# Altium schematic sheet uMultimeter_MAIN_Sch.SchDoc: MicroMultimeter
size 203 x 127 mm; Author: Hom; CompanyName: KitSprout; DrawnBy: Hom; Engineer: Hom; Organization: KitSprout; Revision: B; SheetNumber: 1; SheetTotal: 1; License: CC BY-SA 4.0; Version: 2.0; LibVersion: 2.1; PageSetup: Record=PageOptions|CenterHorizontal=True|CenterVertical=True|PrintScale=1.00|XCorrection=1.00|YCorrection=1.00|PrintKind=0|BorderSize=5000000|LeftOffset=0|BottomOffset=0|Orientation=2|PaperLength=1000|PaperWidth=1000|Scale=100|PaperSource=7|PrintQuality=-3|MediaType=1|DitherType=10|PrintScaleMode=0|PaperKind=A4|PaperIndex=9
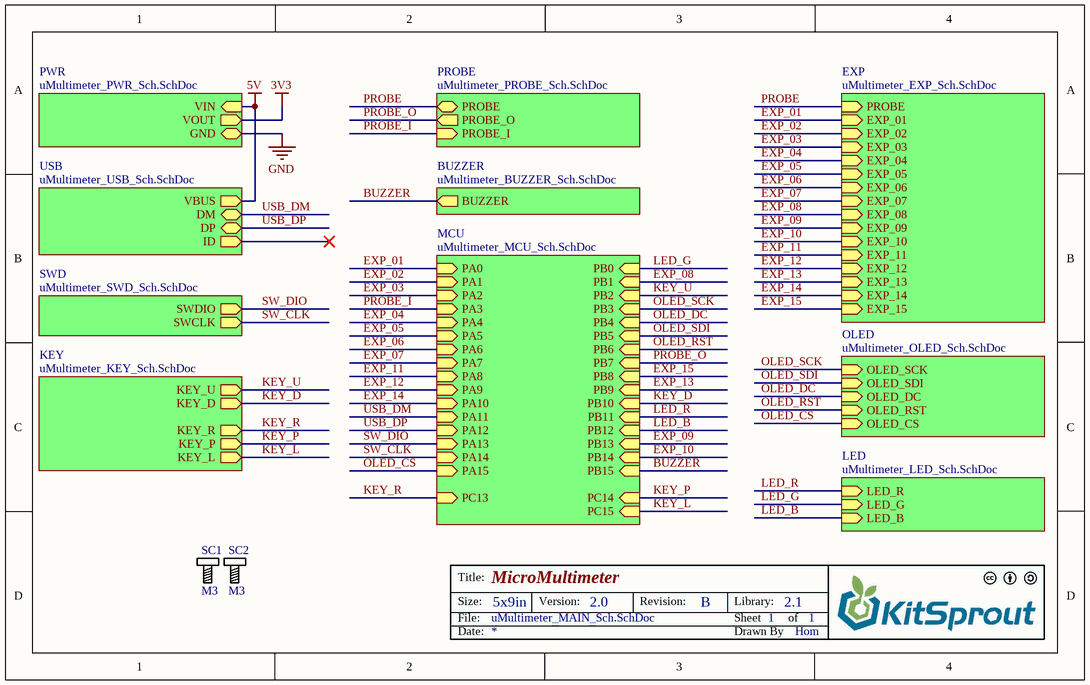
[diagram p0: uMultimeter_MAIN_Sch.SchDoc]

## Parts
SC1  M3  [SCRREW_M3]
SC2  M3  [SCRREW_M3]

## Sub-sheets
BUZZER = uMultimeter_BUZZER_Sch.SchDoc: BUZZER (out)
EXP = uMultimeter_EXP_Sch.SchDoc: PROBE (in), EXP_01 (in), EXP_02 (in), EXP_03 (in), EXP_04 (in), EXP_05 (in), EXP_06 (in), EXP_07 (in), EXP_08 (in), EXP_09 (in), EXP_10 (in), EXP_11 (in), EXP_12 (in), EXP_13 (in), EXP_14 (in), EXP_15 (in)
KEY = uMultimeter_KEY_Sch.SchDoc: KEY_D (out), KEY_U (out), KEY_P (out), KEY_R (out), KEY_L (out)
LED = uMultimeter_LED_Sch.SchDoc: LED_G (in), LED_R (in), LED_B (in)
MCU = uMultimeter_MCU_Sch.SchDoc: PA0 (in), PA1 (in), PA2 (in), PA3 (in), PA4 (in), PA5 (in), PA6 (in), PA7 (in), PA8 (in), PA9 (in), PA10 (in), PA11 (in), PA12 (in), PA13 (in), PA14 (in), PA15 (in), PB0 (in), PB1 (in), PB2 (in), PB3 (in), PB4 (in), PB5 (in), PB6 (in), PB7 (in), PB8 (in), PB9 (in), PB10 (in), PB11 (in), PB12 (in), PB13 (in), PB14 (in), PB15 (in), PC13 (in), PC14 (in), PC15 (in)
OLED = uMultimeter_OLED_Sch.SchDoc: OLED_SDI (in), OLED_SCK (in), OLED_DC (in), OLED_RST (in), OLED_CS (in)
PROBE = uMultimeter_PROBE_Sch.SchDoc: PROBE (bidir), PROBE_I (in), PROBE_O (out)
PWR = uMultimeter_PWR_Sch.SchDoc: VOUT (out), VIN (in), GND (bidir)
SWD = uMultimeter_SWD_Sch.SchDoc: SWDIO (out), SWCLK (out)
USB = uMultimeter_USB_Sch.SchDoc: DM (bidir), VBUS (out), DP (bidir), ID (out)

## Nets
3V3: sheet PWR/VOUT
5V: sheet PWR/VIN, sheet USB/VBUS
GND: sheet PWR/GND
BUZZER: sheet BUZZER/BUZZER, sheet MCU/PB15
EXP_01: sheet EXP/EXP_01, sheet MCU/PA0
EXP_02: sheet EXP/EXP_02, sheet MCU/PA1
EXP_03: sheet EXP/EXP_03, sheet MCU/PA2
EXP_04: sheet EXP/EXP_04, sheet MCU/PA4
EXP_05: sheet EXP/EXP_05, sheet MCU/PA5
EXP_06: sheet EXP/EXP_06, sheet MCU/PA6
EXP_07: sheet EXP/EXP_07, sheet MCU/PA7
EXP_08: sheet EXP/EXP_08, sheet MCU/PB1
EXP_09: sheet EXP/EXP_09, sheet MCU/PB13
EXP_10: sheet EXP/EXP_10, sheet MCU/PB14
EXP_11: sheet EXP/EXP_11, sheet MCU/PA8
EXP_12: sheet EXP/EXP_12, sheet MCU/PA9
EXP_13: sheet EXP/EXP_13, sheet MCU/PB9
EXP_14: sheet EXP/EXP_14, sheet MCU/PA10
EXP_15: sheet EXP/EXP_15, sheet MCU/PB8
KEY_D: sheet KEY/KEY_D, sheet MCU/PB10
KEY_L: sheet KEY/KEY_L, sheet MCU/PC15
KEY_P: sheet KEY/KEY_P, sheet MCU/PC14
KEY_R: sheet KEY/KEY_R, sheet MCU/PC13
KEY_U: sheet KEY/KEY_U, sheet MCU/PB2
LED_B: sheet LED/LED_B, sheet MCU/PB12
LED_G: sheet LED/LED_G, sheet MCU/PB0
LED_R: sheet LED/LED_R, sheet MCU/PB11
OLED_CS: sheet OLED/OLED_CS, sheet MCU/PA15
OLED_DC: sheet OLED/OLED_DC, sheet MCU/PB4
OLED_RST: sheet OLED/OLED_RST, sheet MCU/PB6
OLED_SCK: sheet OLED/OLED_SCK, sheet MCU/PB3
OLED_SDI: sheet OLED/OLED_SDI, sheet MCU/PB5
PROBE: sheet PROBE/PROBE, sheet EXP/PROBE
PROBE_I: sheet PROBE/PROBE_I, sheet MCU/PA3
PROBE_O: sheet PROBE/PROBE_O, sheet MCU/PB7
SW_CLK: sheet SWD/SWCLK, sheet MCU/PA14
SW_DIO: sheet SWD/SWDIO, sheet MCU/PA13
USB_DM: sheet USB/DM, sheet MCU/PA11
USB_DP: sheet USB/DP, sheet MCU/PA12

## Notes on the sheet
- Title:
- Size:
- Date:
- File:
- 5x9in
- Version:
- Revision:
- Sheet
- Drawn By
- Library:
- of

## Library data of the parts
SC1 SC2 = Screw_M3: Screw